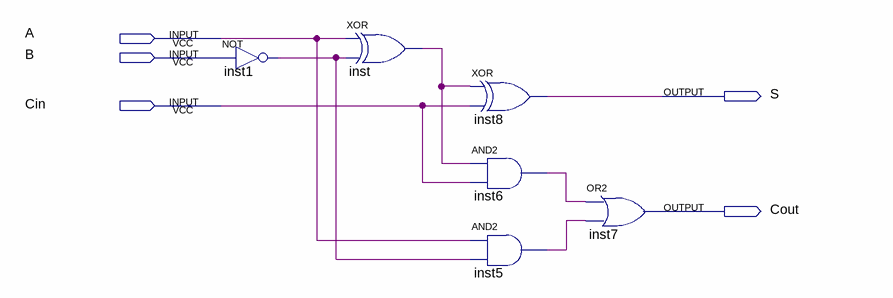
[diagram p0: schematic sheet]
// Quartus schematic Subtractor.bdf as structural Verilog: 6 symbols, 5 pins
module Subtractor (
  input  A,
  input  B,
  input  Cin,
  output S,
  output Cout
);

  wire inst1_out, inst5_out, inst6_out, inst_out;

  not inst1 (inst1_out, B);
  xor inst (inst_out, A, inst1_out);
  xor inst8 (S, inst_out, Cin);
  and inst6 (inst6_out, inst_out, Cin);
  and inst5 (inst5_out, A, inst1_out);
  or inst7 (Cout, inst6_out, inst5_out);
endmodule
